# EAGLE design watering_uzin (EAGLE 8.0.1)
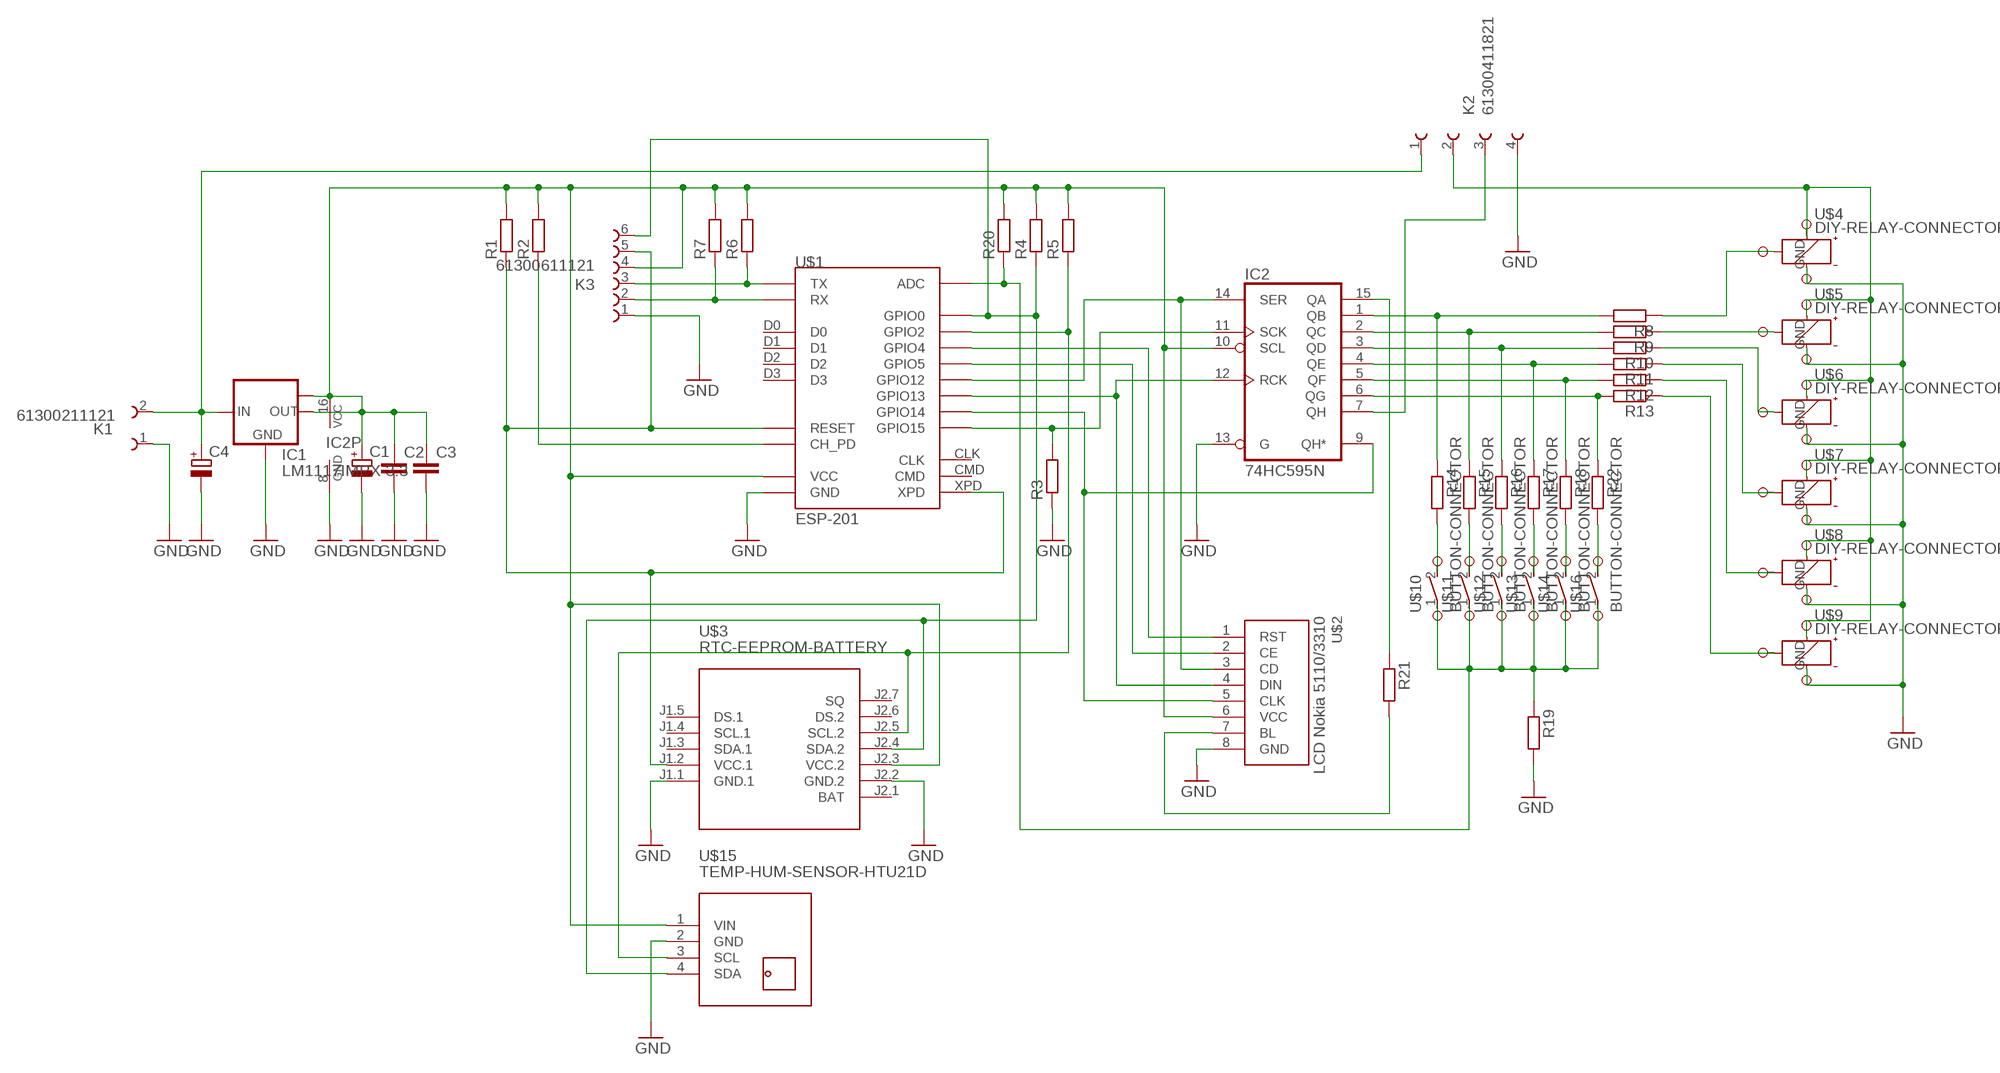
[diagram p0: schematic, sheet 1]

## Parts
C1  CPOL-EUSANYO_F13  [SANYO-OSCON_F13]
C2  C-EUC1210  [C1210]
C3  C-EUC1210  [C1210]
C4  CPOL-EUSANYO_F13  [SANYO-OSCON_F13]
IC1  LM1117IMPX-3.3  [SOT223]
IC2  74HC595N  [DIL16]
K1  61300211121  [61300211121]
K2  61300411821  [61300411821]
K3  61300611121  [61300611121]
R1  R-EU_R0805  [R0805]
R2  R-EU_R0805  [R0805]
R3  R-EU_R0805  [R0805]
R4  R-EU_R0805  [R0805]
R5  R-EU_R0805  [R0805]
R6  R-EU_R0805  [R0805]
R7  R-EU_R0805  [R0805]
R8  R-EU_R0805  [R0805]
R9  R-EU_R0805  [R0805]
R10  R-EU_R0805  [R0805]
R11  R-EU_R0805  [R0805]
R12  R-EU_R0805  [R0805]
R13  R-EU_R0805  [R0805]
R14  R-EU_R0805  [R0805]
R15  R-EU_R0805  [R0805]
R16  R-EU_R0805  [R0805]
R17  R-EU_R0805  [R0805]
R18  R-EU_R0805  [R0805]
R19  R-EU_R0805  [R0805]
R20  R-EU_R0805  [R0805]
R21  R-EU_R0805  [R0805]
R22  R-EU_R0805  [R0805]
U$1  ESP-201  [ESP-201]
U$2  NOKIA5110  [NOKIA5110]
U$3  RTC-EEPROM-BATTERY  [RTC-EEPROM-BATTERY]
U$4  DIY-RELAY-CONNECTOR  [DIY-RELAY-CONNECTOR]
U$5  DIY-RELAY-CONNECTOR  [DIY-RELAY-CONNECTOR]
U$6  DIY-RELAY-CONNECTOR  [DIY-RELAY-CONNECTOR]
U$7  DIY-RELAY-CONNECTOR  [DIY-RELAY-CONNECTOR]
U$8  DIY-RELAY-CONNECTOR  [DIY-RELAY-CONNECTOR]
U$9  DIY-RELAY-CONNECTOR  [DIY-RELAY-CONNECTOR]
U$10  BUTTON-CONNECTOR  [BUTTON-CONNECTOR]
U$11  BUTTON-CONNECTOR  [BUTTON-CONNECTOR]
U$12  BUTTON-CONNECTOR  [BUTTON-CONNECTOR]
U$13  BUTTON-CONNECTOR  [BUTTON-CONNECTOR]
U$14  BUTTON-CONNECTOR  [BUTTON-CONNECTOR]
U$15  TEMP-HUM-SENSOR-HTU21D  [TEMP-HUM-SENSOR-HTU21D]
U$16  BUTTON-CONNECTOR  [BUTTON-CONNECTOR]

## Nets
GND: C1.- C2.2 C3.2 C4.- IC1.1(GND) IC2.8(GND) IC2.13(G) K1.1 K2.4 K3.1 R3.1 R19.2 U$1.GND U$1.GND_2(GND) U$1.GND_3(GND) U$2.8(GND) U$3.J1.1(GND.1) U$3.J2.2(GND.2) U$4.GND U$5.GND U$6.GND U$7.GND U$8.GND U$9.GND U$15.2(GND)
N$1: K3.5 R1.1 U$1.RST(RESET) U$1.XPD U$3.J1.2(VCC.1)
N$2: R2.1 U$1.CH_PD
N$3: R8.1 U$4.IN
N$4: R9.1 U$5.IN
N$5: R10.1 U$6.IN
N$6: IC2.9(QH*) U$1.GPIO14 U$2.5(CLK)
N$7: IC2.11(SCK) R3.2 U$1.GPIO15
N$8: K3.6 R4.1 U$1.GPIO0 U$3.J2.4(SDA.2) U$15.4(SDA)
N$9: R5.1 U$1.GPIO2 U$3.J2.5(SCL.2) U$15.3(SCL)
N$10: R19.1 R20.1 U$1.ADC U$10.1(P) U$11.1(P) U$12.1(P) U$13.1(P) U$14.1(P) U$16.1(P)
N$11: K3.3 R6.1 U$1.TX
N$12: IC2.14(SER) U$1.GPIO12 U$2.3(CD)
N$13: IC2.12(RCK) U$1.GPIO13 U$2.4(DIN)
N$14: R21.2 U$2.7(BL)
N$15: U$1.GPIO4 U$2.1(RST)
N$16: U$1.GPIO5 U$2.2(CE)
N$17: R11.1 U$7.IN
N$18: R12.1 U$8.IN
N$19: R13.1 U$9.IN
N$20: K2.2 U$4.VCC U$5.VCC U$6.VCC U$7.VCC U$8.VCC U$9.VCC
N$21: IC2.1(QB) R8.2 R14.1
N$22: IC2.2(QC) R9.2 R15.1
N$23: IC2.3(QD) R10.2 R16.1
N$24: IC2.4(QE) R11.2 R17.1
N$25: IC2.5(QF) R12.2 R18.1
N$26: IC2.6(QG) R13.2 R22.1
N$27: R14.2 U$10.2(S)
N$28: R15.2 U$11.2(S)
N$29: R16.2 U$12.2(S)
N$30: R17.2 U$13.2(S)
N$31: R18.2 U$14.2(S)
N$32: C4.+ IC1.3(IN) K1.2 K2.1
N$33: IC2.7(QH) K2.3
N$34: K3.2 R7.1 U$1.RX
N$35: R22.2 U$16.2(S)
N$36: IC2.15(QA) R21.1
VCC: C1.+ C2.1 C3.1 IC1.2(OUT) IC1.TAB(OUT1) IC2.10(SCL) IC2.16(VCC) K3.4 R1.2 R2.2 R4.2 R5.2 R6.2 R7.2 R20.2 U$1.3V3(VCC) U$1.3V3_2(VCC) U$1.3V3_3(VCC) U$2.6(VCC) U$3.J2.3(VCC.2) U$15.1(VIN)
Unconnected: U$1.CLK U$1.CMD U$1.D0 U$1.D1 U$1.D2 U$1.D3 U$3.J1.3(SDA.1) U$3.J1.4(SCL.1) U$3.J1.5(DS.1) U$3.J2.1(BAT) U$3.J2.6(DS.2) U$3.J2.7(SQ)

## Library data of the parts
C1 C4 = rcl:CPOL-EU: POLARIZED CAPACITOR, European symbol
C2 C3 = rcl:C-EU: CAPACITOR, European symbol
IC1 = lm1117:LM1117IMPX-*
IC2 = 74xx-eu:74*595: 8-bit SHIFT REGISTER, output latch
K1 = Board_to_Board_Connectors_rev15d:61300211121: WR-PHD 2.54mm Pin Header, 2 Pin=>Code : Con_BTB_PHD_2.54_1_THT_61300211121 <http://katalog.we-online.de/media/images/eican/Con_BTB_PHD_2.54_1_THT_6130xx11121_pf2.jpg> Details see: http://katalog.we-online.de/en/em/613_0xx_111_21 Created 2014-05-29, Karrer Zheng 2014 (C) Würth Elektronik
K2 = Board_to_Board_Connectors_rev15d:61300411821: WR-PHD 2.54mm Socket Header, 4 Pins =>Code : Con_BTB_SHD_2.54_1_THT_61300411821 <http://katalog.we-online.de/media/images/eican/Con_BTB_SHD_2.54_1_THT_6130xx11821_pf2.jpg> Details see: http://katalog.we-online.de/en/em/613_0xx_118_21 Created 2014-05-29, Karrer Zheng 2014 (C) Würth Elektronik
K3 = Board_to_Board_Connectors_rev15d:61300611121: WR-PHD 2.54mm Pin Header, 6 Pin =>Code : Con_BTB_PHD_2.54_1_THT_61300611121 <http://katalog.we-online.de/media/images/eican/Con_BTB_PHD_2.54_1_THT_6130xx11121_pf2.jpg> Details see: http://katalog.we-online.de/en/em/613_0xx_111_21 Created 2014-05-29, Karrer Zheng 2014 (C) Würth Elektronik
R1-R22 = resistor:R-EU_: RESISTOR, European symbol
U$1 = esp8266modules:ESP-201: ESP8266 Wifi Module ESP-201; DIMENSIONS: 25 x 35 mm; PINS: 26; PITCH: 0.1" / 2.54 mm
U$2 = _LCD_Nokia5110:NOKIA5110: Monochrome LCD Module from Nokia 5110/3310 with controller PCD8544. 8 pins x 2,54mm on bottom side. 45,5 mm x 42,5 mm
U$3 = diy-modules:RTC-EEPROM-BATTERY: RTC Module with Battery and EEPROM based on DS1307 and AT24C32 chips More details available here: http://henrysbench.capnfatz.com/henrys-bench/arduino-sensors-and-input/arduino-tiny-rtc-d1307-tutorial/ Click here to find device on ebay.com <http://www.ebay.com/sch/tiny+rtc+arduino>
U$4-U$9 = connectors:DIY-RELAY-CONNECTOR
U$10-U$14 U$16 = connectors:BUTTON-CONNECTOR
U$15 = diy-modules:TEMP-HUM-SENSOR-HTU21D: Digital Humidity & Temperature Sensor based on HTU21D device More information about HTU21D device is available here: http://futureeverything.org/wp-content/uploads/2014/05/Humidity-Datasheet.pdf HTU21D Arudino Library is available here: https://learn.sparkfun.com/tutorials/htu21d-humidity-sensor-hookup-guide/htu21d-library-and-functions Click here to find device on ebay.com <http://www.ebay.com/sch/htu21d+board>

## Net classes
0 default: clearance 0.205 mm

## Board
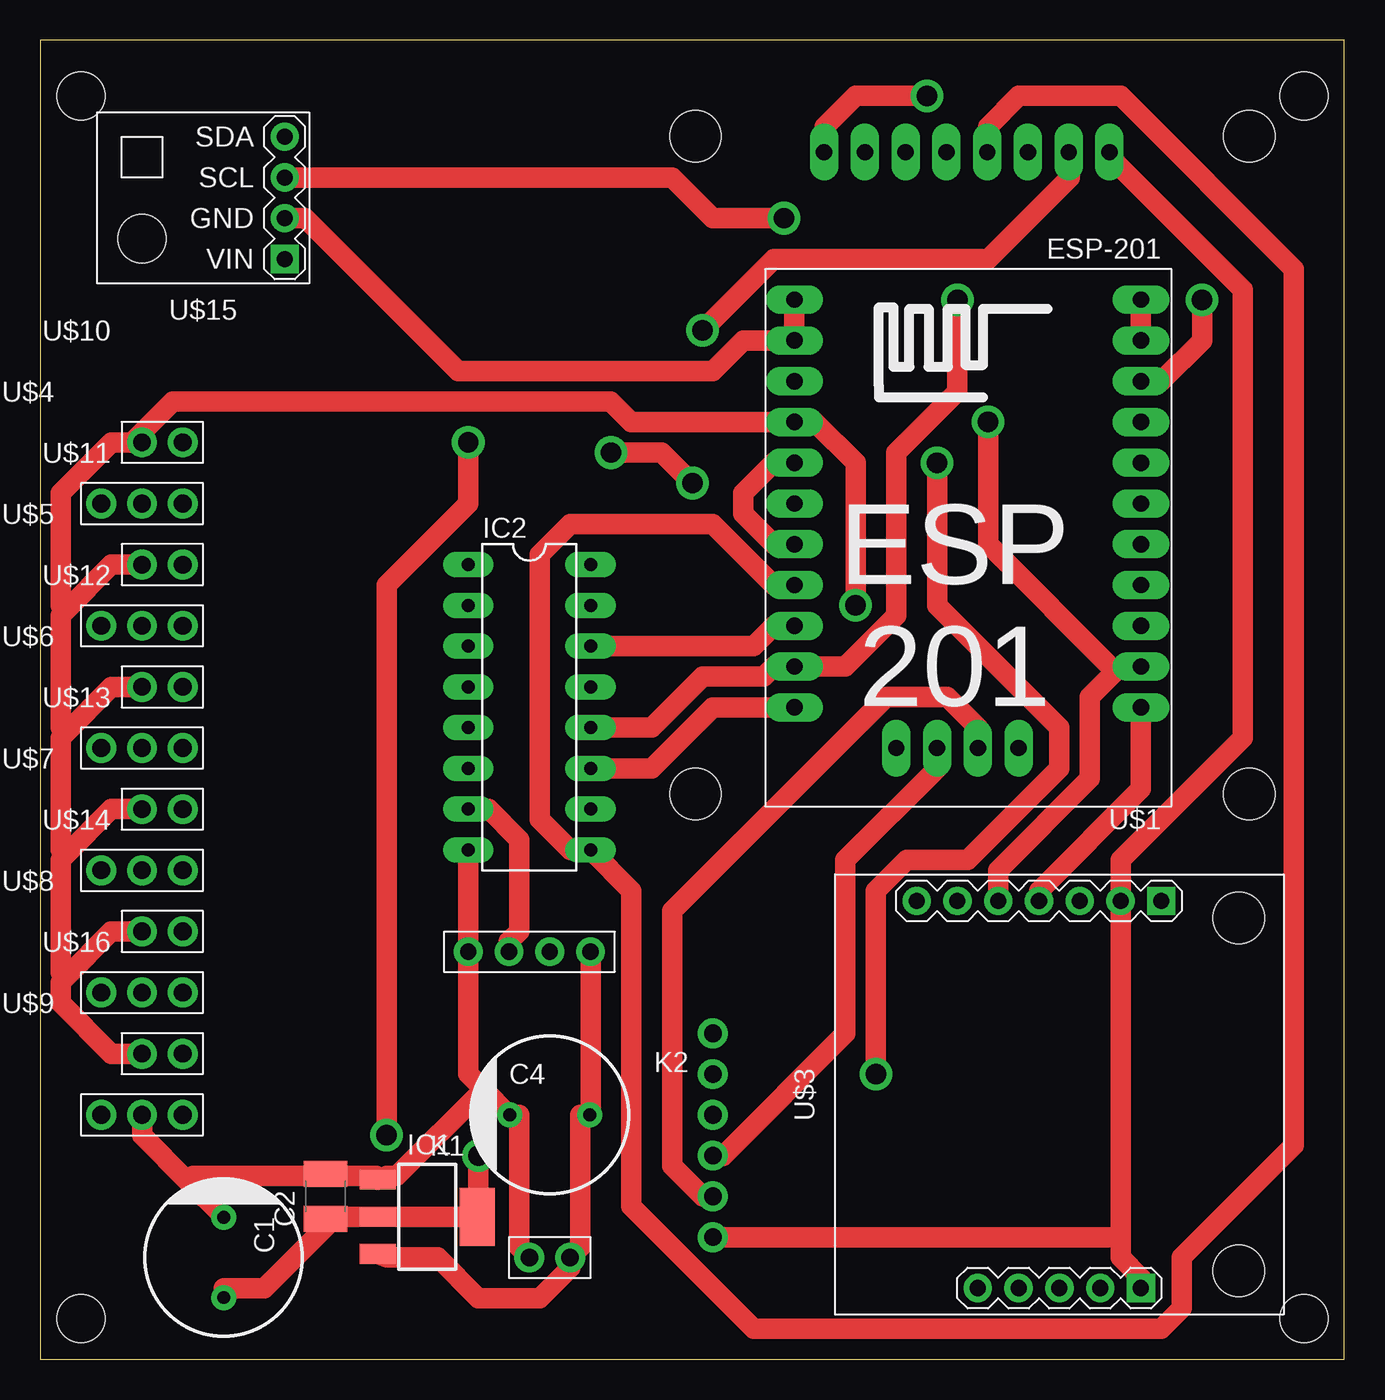
[diagram p1: board, top side]
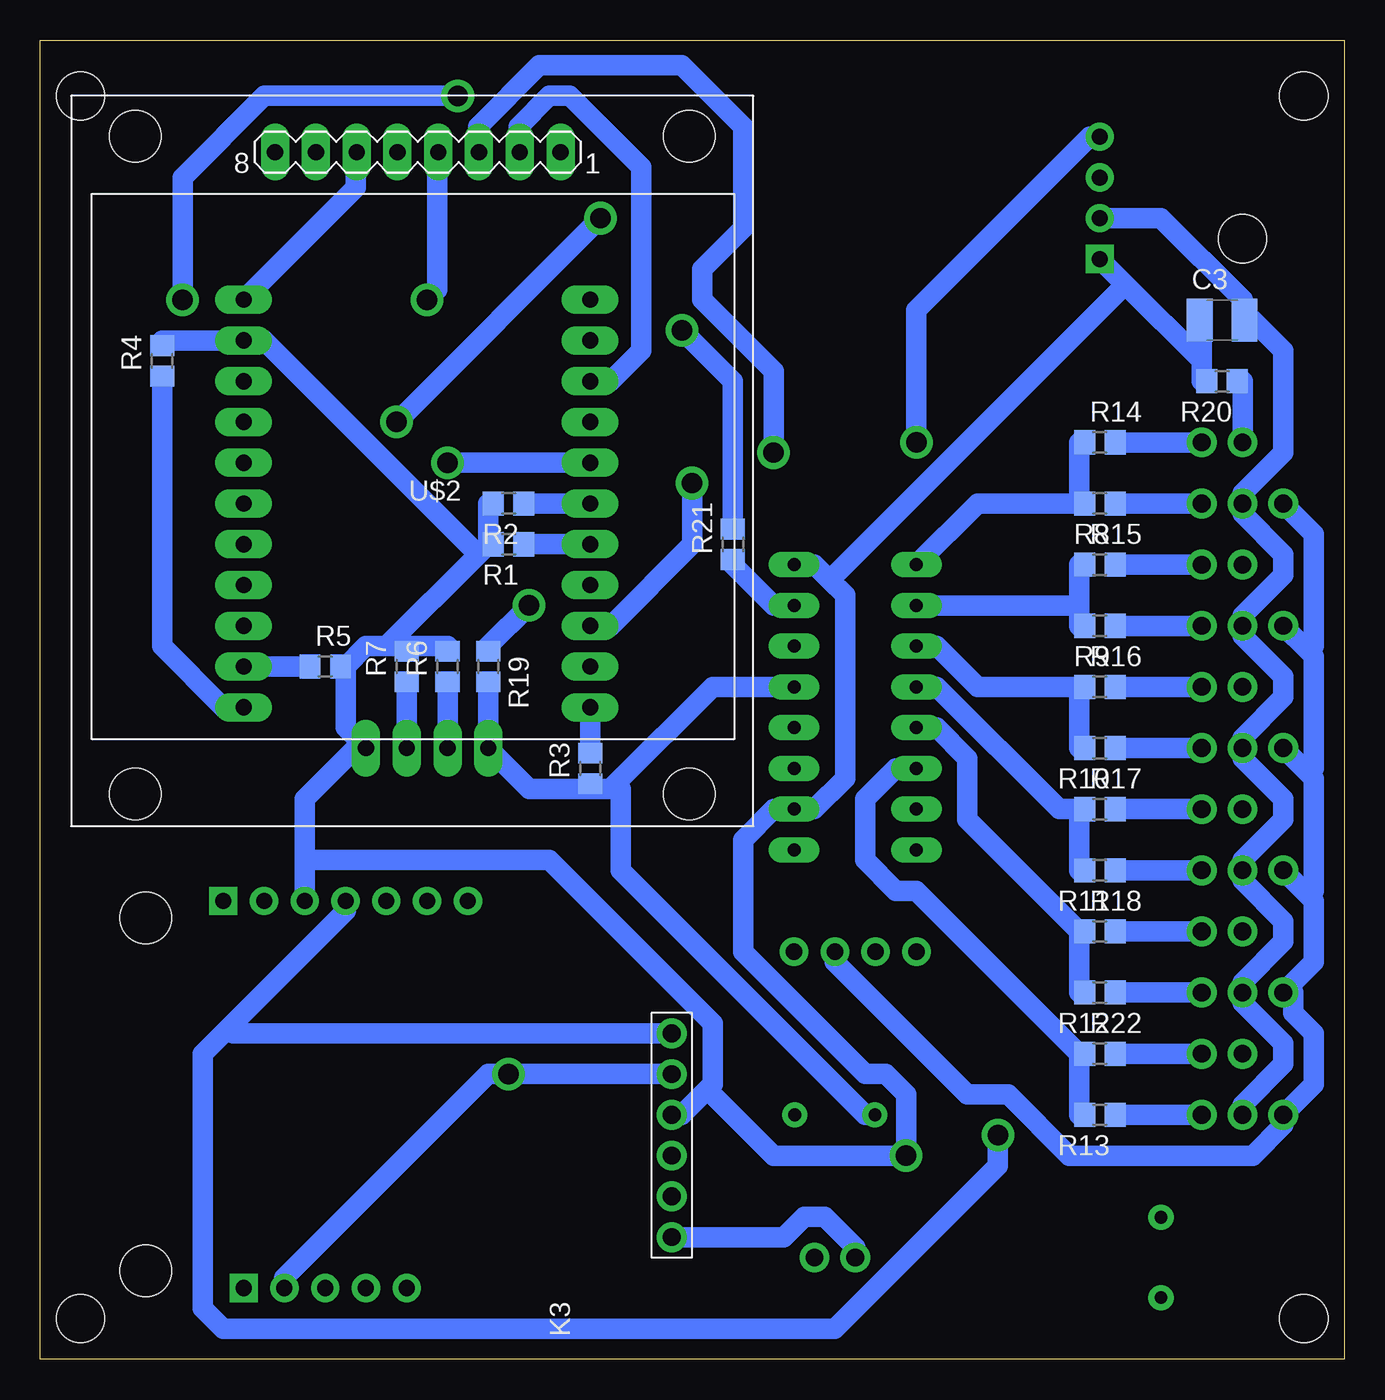
[diagram p2: board, bottom side, seen from below]

Size 81.26 x 82.22 mm. Coordinates in mm from the lower left corner, seen from the top.
Outline: 0,0 81.26,0 81.26,82.22 0,82.22 0,0
Copper layers (1*16): Top 0.035mm / dielectric 1.5mm / Bottom 0.035mm
Design rules "default *": minimum track width 50mil, minimum drill 50mil, track to track 20mil, track to pad 20mil, pad to pad 20mil, via to via 20mil, smd to smd 8mil, copper to edge 20mil, drill to drill 20mil, minimum pad ring 15mil, minimum via ring 15mil, stop-mask expansion 4mil, vias tented up to drill 0mil, thermal gap 10mil
Holes 3 mm at 2.54,2.54 78.74,2.54 78.74,78.74 2.54,78.74

### Footprints (pad centres in the part's own frame; a part is rotated, then mirrored left to right if it is on the bottom)
SANYO-OSCON_F13 = drill 0.8 pad 1.27: + 2.5,0; - -2.5,0
C1210 = smd 1.6 x 2.7: 1 -1.4,0; 2 1.4,0
SOT223 = smd 1.219 x 2.235: 1 -2.311,-3.099; 2 0,-3.099; 3 2.311,-3.099 | smd 3.6 x 2.2: TAB 0,3.099
DIL16 = drill 0.813 long: 1 -8.89,-3.81; 2 -6.35,-3.81; 3 -3.81,-3.81; 4 -1.27,-3.81; 5 1.27,-3.81; 6 3.81,-3.81; 7 6.35,-3.81; 8 8.89,-3.81; 9 8.89,3.81; 10 6.35,3.81; 11 3.81,3.81; 12 1.27,3.81; 13 -1.27,3.81; 14 -3.81,3.81; 15 -6.35,3.81; 16 -8.89,3.81
61300211121 = drill 1.1: 1 -1.27,0; 2 1.27,0
61300411821 = drill 1.02: 1 -3.81,0; 2 -1.27,0; 3 1.27,0; 4 3.81,0
61300611121 = drill 1.1: 1 -6.35,0; 2 -3.81,0; 3 -1.27,0; 4 1.27,0; 5 3.81,0; 6 6.35,0
R0805 = smd 1.3 x 1.5: 1 -0.95,0; 2 0.95,0
ESP-201 = drill 1.016 long: 3V3 0,2.54; 3V3_2 0,0; 3V3_3 7.62,27.94; ADC 21.59,7.62; CH_PD 21.59,12.7; CLK 0,17.78; CMD 0,15.24; D0 0,12.7; D1 0,10.16; D2 0,20.32; D3 0,7.62; GND 21.59,2.54; GND_2 21.59,0; GND_3 15.24,27.94; GPIO0 0,25.4; GPIO2 0,22.86; GPIO4 0,5.08; GPIO5 21.59,5.08; GPIO12 21.59,20.32; GPIO13 21.59,22.86; GPIO14 21.59,17.78; GPIO15 21.59,25.4; RST 21.59,10.16; RX 10.16,27.94; TX 12.7,27.94; XPD 21.59,15.24
NOKIA5110 = drill 1.016 long: 1 -8.31,-18.09; 2 -5.77,-18.09; 3 -3.23,-18.09; 4 -0.69,-18.09; 5 1.85,-18.09; 6 4.39,-18.09; 7 6.93,-18.09; 8 9.47,-18.09 | hole 3.2: -16.32,21.91; 18.18,21.91; -16.32,-19.09; 18.18,-19.09
RTC-EEPROM-BATTERY = drill 1 square: J1.1 -12.065,-5.08; J2.1 12.065,-6.35 | drill 1: J1.2 -12.065,-2.54; J1.3 -12.065,0; J1.4 -12.065,2.54; J1.5 -12.065,5.08; J2.2 12.065,-3.81; J2.3 12.065,-1.27; J2.4 12.065,1.27; J2.5 12.065,3.81; J2.6 12.065,6.35; J2.7 12.065,8.89 | hole 3.2: -11,-11.176; 11,-11.176
DIY-RELAY-CONNECTOR = drill 1.1: GND 3.81,1.27; IN 6.35,1.27; VCC 1.27,1.27
BUTTON-CONNECTOR = drill 1.1: 1 1.27,1.27; 2 3.81,1.27
TEMP-HUM-SENSOR-HTU21D = drill 1 square: 1 -5.08,3.81 | drill 1: 2 -5.08,1.27; 3 -5.08,-1.27; 4 -5.08,-3.81 | hole 3: 3.81,2.54

### Placement (x,y rotation side)
C1  11.43,6.35 270 top
C2  17.78,10.16 90 top
C3  7.62,64.77 0 bottom
C4  31.75,15.24 0 top
IC1  24.13,8.89 270 top
IC2  30.48,40.64 270 top
K1  31.75,6.35 0 top
K2  30.48,25.4 180 top
K3  41.91,13.97 90 bottom
R1  52.07,50.8 180 bottom
R2  52.07,53.34 180 bottom
R3  46.99,36.83 90 bottom
R4  73.66,62.23 90 bottom
R5  63.5,43.18 0 bottom
R6  55.88,43.18 90 bottom
R7  58.42,43.18 90 bottom
R8  15.24,53.34 180 bottom
R9  15.24,45.72 180 bottom
R10  15.24,38.1 180 bottom
R11  15.24,30.48 180 bottom
R12  15.24,22.86 180 bottom
R13  15.24,15.24 180 bottom
R14  15.24,57.15 0 bottom
R15  15.24,49.53 0 bottom
R16  15.24,41.91 0 bottom
R17  15.24,34.29 0 bottom
R18  15.24,26.67 0 bottom
R19  53.34,43.18 270 bottom
R20  7.62,60.96 180 bottom
R21  38.1,50.8 90 bottom
R22  15.24,19.05 0 bottom
U$1  68.58,66.04 180 top
U$2  57.15,57.15 180 bottom
U$3  63.5,16.51 90 top
U$4  2.54,52.07 0 top
U$5  2.54,44.45 0 top
U$6  2.54,36.83 0 top
U$7  2.54,29.21 0 top
U$8  2.54,21.59 0 top
U$9  2.54,13.97 0 top
U$10  5.08,55.88 0 top
U$11  5.08,48.26 0 top
U$12  5.08,40.64 0 top
U$13  5.08,33.02 0 top
U$14  5.08,25.4 0 top
U$15  10.16,72.39 180 top
U$16  5.08,17.78 0 top

### Tracks (layer width: path | path; a pad name or v marks a point on that pad's centre or on a via)
GND
  Top 1.27: 67.31,7.62 67.31,6.35 68.58,5.08 U$3.J1.1 | 67.31,7.62 U$3.J2.2 67.31,31.11 74.93,38.73 74.93,66.67 66.67,74.93 U$2.8 | 67.31,7.62 K3.1 | U$1.GND_2 U$1.GND 43.81,63.5 41.91,61.59 26.04,61.59 16.51,71.12 U$15.2 | 17.78,11.43 20.95,11.43 IC1.1 21.59,11.43 22.23,11.43 27.62,16.83 | 9.21,11.11 6.35,13.97 U$9.GND | 9.21,11.11 11.43,8.89 C1.- | 17.78,11.43 9.53,11.43 9.21,11.11 | 17.78,11.43 C2.2 | IC2.8 K2.4 26.67,17.78 27.62,16.83 | K1.1 29.84,6.99 29.84,15.24 C4.- 29.21,15.24 27.62,16.83
  Bottom 1.27: U$15.2 11.43,71.12 6.35,66.04 6.35,64.77 C3.2 5.71,64.77 3.81,62.87 3.81,56.52 6.35,53.98 U$4.GND 6.35,52.7 3.81,50.16 3.81,48.9 6.35,46.35 U$5.GND 6.35,45.09 3.81,42.55 3.81,41.27 6.35,38.73 U$6.GND 6.35,37.47 3.81,34.92 3.81,33.66 6.35,31.11 U$7.GND 6.35,29.84 3.81,27.3 3.81,26.04 6.35,23.5 U$8.GND 6.35,22.23 3.81,19.68 3.81,18.41 6.35,15.88 U$9.GND | 46.99,35.56 50.8,35.56 U$1.GND_3 R19.2 | IC2.13 39.37,41.91 45.4,35.88 | 45.4,35.88 45.72,35.56 46.99,35.56 | 46.99,35.56 R3.1 | 45.4,35.88 45.09,35.56 45.09,30.48 29.84,15.24 C4.- | K3.1 34.92,7.62 33.66,8.89 32.38,8.89 30.48,6.99 K1.1
N$1  (via drill 1.27)
  Top 1.27: U$1.RST 45.72,55.88 43.81,53.98 43.81,52.7 45.72,50.8 U$1.XPD | v55.88,55.88 55.88,46.99 63.5,39.37 63.5,36.83 57.78,31.11 53.98,31.11 52.07,29.21 v52.07,17.78
  Bottom 1.27: U$1.XPD R1.1 | U$3.J1.2 66.04,5.08 53.34,17.78 v52.07,17.78 K3.5 | v55.88,55.88 U$1.RST
N$2
  Bottom 1.27: U$1.CH_PD R2.1
N$3
  Bottom 1.27: U$4.IN R8.1
N$4
  Bottom 1.27: U$5.IN R9.1
N$5
  Bottom 1.27: U$6.IN R10.1
N$6
  Top 1.27: U$1.GPIO14 45.72,48.26 41.91,52.07 33.02,52.07 31.11,50.16 31.11,33.66 33.02,31.75 IC2.9 36.83,29.21 36.83,9.53 44.45,1.91 69.85,1.91 71.12,3.17 71.12,6.35 78.11,13.34 78.11,67.94 67.31,78.74 60.96,78.74 59.05,76.83 59.05,75.56 U$2.5
N$7
  Top 1.27: IC2.11 38.1,36.83 41.91,40.64 U$1.GPIO15
  Bottom 1.27: U$1.GPIO15 R3.2
N$8  (via drill 1.27)
  Top 1.27: v26.67,57.15 26.67,53.34 21.59,48.26 v21.59,13.97 | U$1.GPIO0 68.58,35.56 62.23,29.21 U$3.J2.4
  Bottom 1.27: R4.1 73.66,44.45 69.85,40.64 U$1.GPIO0 | U$15.4 15.88,76.2 26.67,65.41 v26.67,57.15 | v21.59,13.97 21.59,12.06 31.75,1.91 69.85,1.91 71.12,3.17 71.12,19.05 69.53,20.64 | 69.53,20.64 62.23,27.94 U$3.J2.4 | K3.6 69.22,20.32 69.53,20.64
N$9  (via drill 1.27)
  Top 1.27: U$3.J2.5 59.69,30.48 65.41,36.2 65.41,41.27 66.99,42.86 | 66.99,42.86 67.31,43.18 U$1.GPIO2 | U$15.3 39.37,73.66 41.91,71.12 v46.35,71.12 | v59.05,58.42 59.05,50.8 66.99,42.86
  Bottom 1.27: U$1.GPIO2 R5.1 | v59.05,58.42 v46.35,71.12
N$10  (via drill 1.27)
  Top 1.27: v50.8,46.99 50.8,55.88 48.26,58.42 U$1.ADC 36.83,58.42 35.56,59.69 8.26,59.69 5.71,57.15 | U$16.1 4.45,19.05 1.27,22.23 1.27,23.5 1.59,23.81 | 1.59,23.81 4.45,26.67 U$14.1 | U$13.1 4.45,34.29 1.59,31.43 | 1.59,31.43 1.27,31.11 1.27,24.13 1.59,23.81 | U$12.1 4.45,41.91 1.59,39.05 | 1.59,39.05 1.27,38.73 1.27,31.75 1.59,31.43 | U$11.1 4.45,49.53 1.59,46.67 | 1.59,46.67 1.27,46.35 1.27,39.37 1.59,39.05 | 5.71,57.15 4.45,57.15 1.27,53.98 1.27,46.99 1.59,46.67 | 5.71,57.15 U$10.1
  Bottom 1.27: v50.8,46.99 53.34,44.45 R19.1 | U$10.1 6.35,60.96 R20.1
N$11
  Top 1.27: K3.3 42.55,12.7 50.16,20.32 50.16,31.11 55.88,36.83 U$1.TX
  Bottom 1.27: U$1.TX R6.1
N$12  (via drill 1.27)
  Top 1.27: IC2.14 44.45,44.45 45.72,45.72 U$1.GPIO12 | v35.56,56.52 38.73,56.52 v40.64,54.61
  Bottom 1.27: v35.56,56.52 35.56,61.59 40.01,66.04 40.01,67.94 37.47,70.48 37.47,76.83 41.27,80.64 50.16,80.64 53.98,76.83 53.98,75.56 U$2.3 | v40.64,54.61 40.64,50.8 45.72,45.72 U$1.GPIO12
N$13  (via drill 1.27)
  Top 1.27: IC2.12 38.1,39.37 41.27,42.55 45.09,42.55 45.72,43.18 U$1.GPIO13 50.16,43.18 53.34,46.35 53.34,56.52 57.15,60.33 v57.15,66.04
  Bottom 1.27: v57.15,66.04 56.52,66.67 56.52,74.93 U$2.4
N$14  (via drill 1.27)
  Top 1.27: v41.27,64.14 45.72,68.58 59.05,68.58 64.14,73.66 64.14,74.93 U$2.7
  Bottom 1.27: R21.2 38.1,60.96 v41.27,64.14
N$15  (via drill 1.27)
  Top 1.27: U$1.GPIO4 69.85,60.96 72.39,63.5 v72.39,66.04 | v55.24,78.74 50.8,78.74 48.9,76.83 48.9,75.56 U$2.1
  Bottom 1.27: v72.39,66.04 72.39,73.66 67.31,78.74 v55.24,78.74
N$16
  Bottom 1.27: U$1.GPIO5 45.72,60.96 43.81,62.87 43.81,74.3 48.26,78.74 49.53,78.74 51.44,76.83 51.44,75.56 U$2.2
N$17
  Bottom 1.27: U$7.IN R11.1
N$18
  Bottom 1.27: U$8.IN R12.1
N$19
  Bottom 1.27: U$9.IN R13.1
N$20
  Bottom 1.27: U$7.VCC 2.22,28.89 | 2.22,28.89 1.91,28.57 1.91,24.77 U$8.VCC 3.17,22.86 3.17,21.59 1.91,20.32 1.91,17.14 U$9.VCC 3.81,14.61 5.71,12.7 17.14,12.7 20.95,16.51 23.5,16.51 31.75,24.77 K2.2 | 2.22,36.51 1.91,36.2 1.91,29.21 2.22,28.89 | 2.22,36.51 U$6.VCC | 2.22,44.13 1.91,43.81 1.91,36.83 2.22,36.51 | 2.22,44.13 U$5.VCC | U$4.VCC 1.91,51.44 1.91,44.45 2.22,44.13
N$21
  Bottom 1.27: 16.51,53.34 16.51,57.15 R14.1 | 16.51,53.34 22.86,53.34 IC2.1 | 16.51,53.34 R8.2
N$22
  Bottom 1.27: 16.51,46.99 16.51,49.53 R15.1 | 16.51,46.99 16.51,45.72 R9.2 | IC2.2 16.51,46.99
N$23
  Bottom 1.27: 16.51,41.91 16.51,38.1 R10.2 | 16.51,41.91 22.86,41.91 25.4,44.45 IC2.3 | 16.51,41.91 R16.1
N$24
  Bottom 1.27: 16.51,34.29 16.51,30.48 R11.2 | 16.51,34.29 17.78,34.29 25.4,41.91 IC2.4 | 16.51,34.29 R17.1
N$25
  Bottom 1.27: 16.51,26.67 16.51,22.86 R12.2 | 16.51,26.67 23.5,33.66 23.5,37.47 25.4,39.37 IC2.5 | 16.51,26.67 R18.1
N$26
  Bottom 1.27: 16.51,19.05 16.51,15.24 R13.2 | 16.51,19.05 26.67,29.21 27.94,29.21 29.84,31.11 29.84,34.92 27.94,36.83 IC2.6 | 16.51,19.05 R22.1
N$27
  Bottom 1.27: U$10.2 R14.2
N$28
  Bottom 1.27: U$11.2 R15.2
N$29
  Bottom 1.27: U$12.2 R16.2
N$30
  Bottom 1.27: U$13.2 R17.2
N$31
  Bottom 1.27: U$14.2 R18.2
N$32
  Top 1.27: K2.1 34.29,15.24 C4.+ 33.66,15.24 33.66,6.99 K1.2 33.02,5.71 31.11,3.81 27.3,3.81 24.77,6.35 21.59,6.35 IC1.3
N$33
  Top 1.27: IC2.7 27.94,34.29 29.84,32.38 29.84,26.67 29.21,26.04 K2.3
N$34
  Top 1.27: K3.2 41.27,10.16 39.37,12.06 39.37,27.94 52.7,41.27 56.52,41.27 58.42,39.37 U$1.RX
  Bottom 1.27: U$1.RX R7.1
N$35
  Bottom 1.27: U$16.2 R22.2
N$36
  Bottom 1.27: IC2.15 35.56,46.99 38.1,49.53 R21.1
VCC  (via drill 1.27)
  Top 1.27: U$1.3V3 U$1.3V3_2 | C1.+ 11.43,4.45 13.97,4.45 17.78,8.26 C2.1 17.78,8.89 IC1.2 IC1.TAB 27.3,8.89 v27.3,12.7
  Bottom 1.27: 8.89,62.23 8.89,64.77 C3.1 | 8.89,62.23 8.89,60.96 R20.2 | 8.89,62.23 13.65,66.99 | 13.65,66.99 U$15.1 | 32.07,48.58 33.02,49.53 IC2.16 | 32.07,48.58 31.11,47.62 31.11,36.2 33.02,34.29 IC2.10 35.56,34.29 37.47,32.38 37.47,25.4 29.84,17.78 28.57,17.78 27.3,16.51 v27.3,12.7 35.56,12.7 39.69,16.83 | 32.07,48.58 13.65,66.99 | R4.2 73.66,63.5 U$1.3V3 67.31,63.5 53.98,50.16 | U$1.3V3_2 61.59,73.03 61.59,74.93 U$2.6 | 53.34,50.8 53.34,53.34 R2.2 | 58.42,44.45 55.88,44.45 R6.2 | 62.23,43.18 62.23,39.37 U$1.3V3_3 61.59,38.1 64.77,34.92 64.77,31.11 | 59.69,44.45 60.96,44.45 62.23,43.18 | 59.69,44.45 58.42,44.45 | 58.42,44.45 R7.2 | 62.23,43.18 R5.2 | 59.69,44.45 53.98,50.16 | 53.98,50.16 53.34,50.8 | 53.34,50.8 R1.2 | 64.77,31.11 U$3.J2.3 | K3.4 41.27,15.24 39.69,16.83 | 39.69,16.83 39.37,17.14 39.37,20.95 49.53,31.11 64.77,31.11